# EAGLE schematic VARIABLE_DC_SUPPLY_schematic (EAGLE 9.6.2)
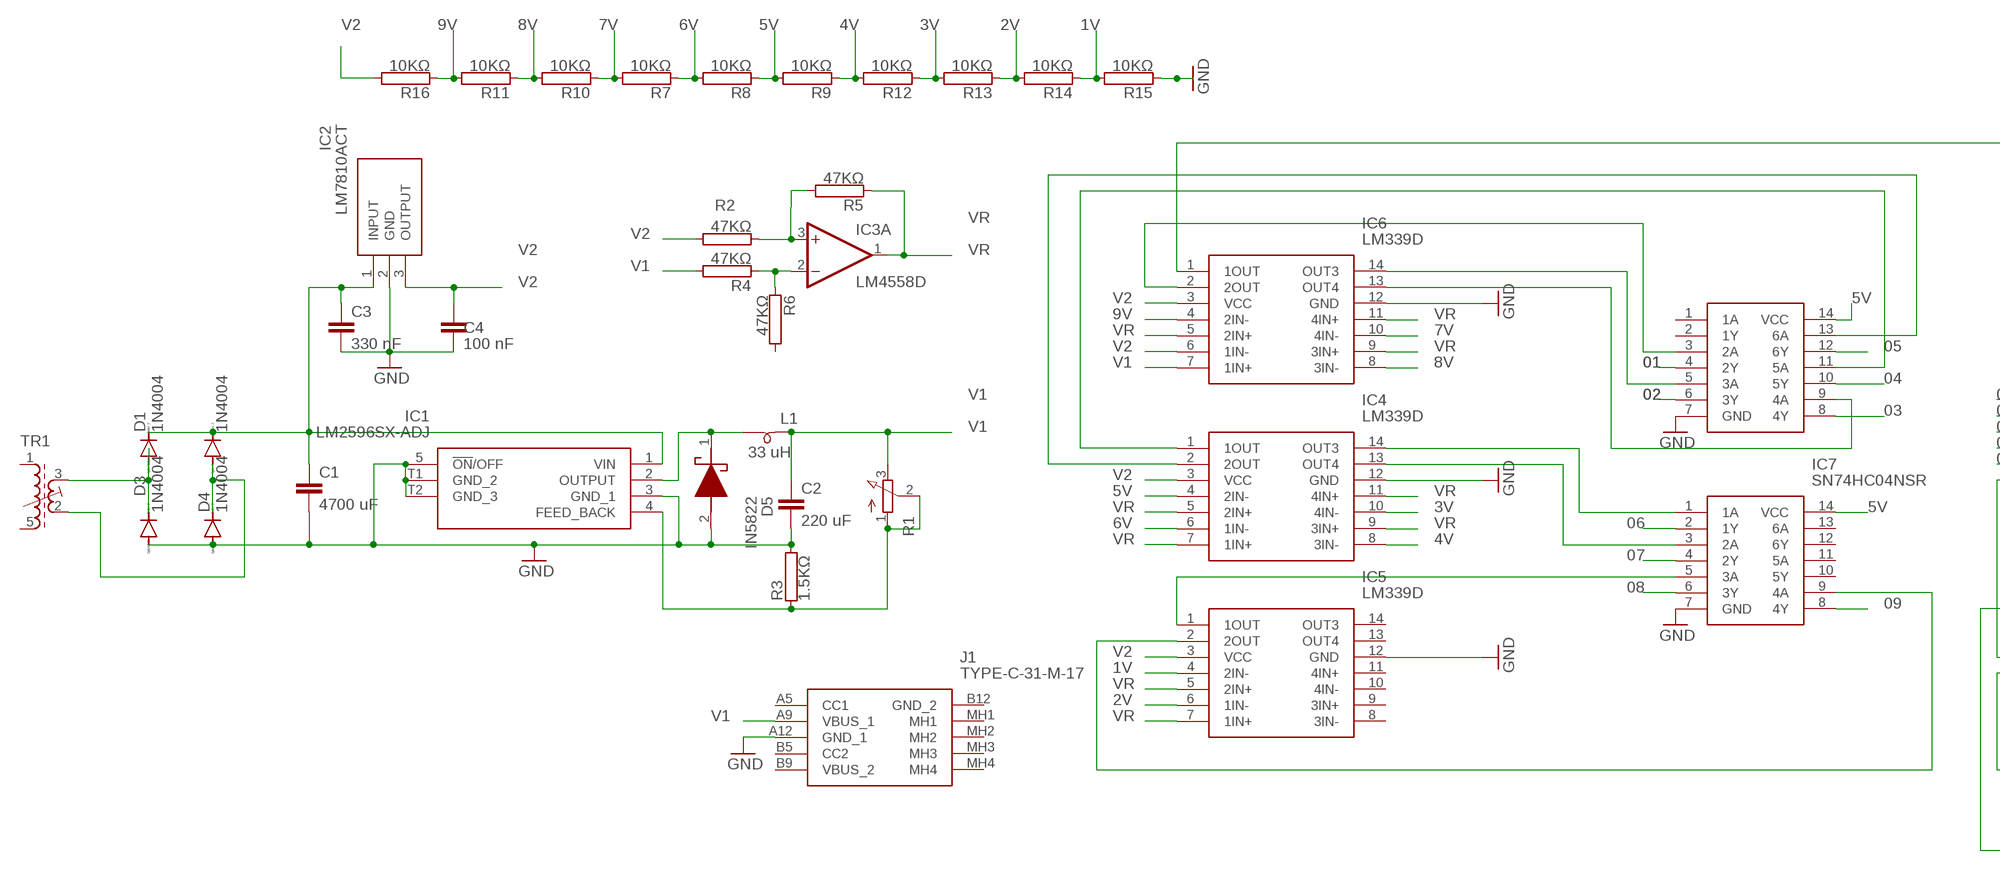
[diagram p0: schematic, sheet 1, part 1 of 2]
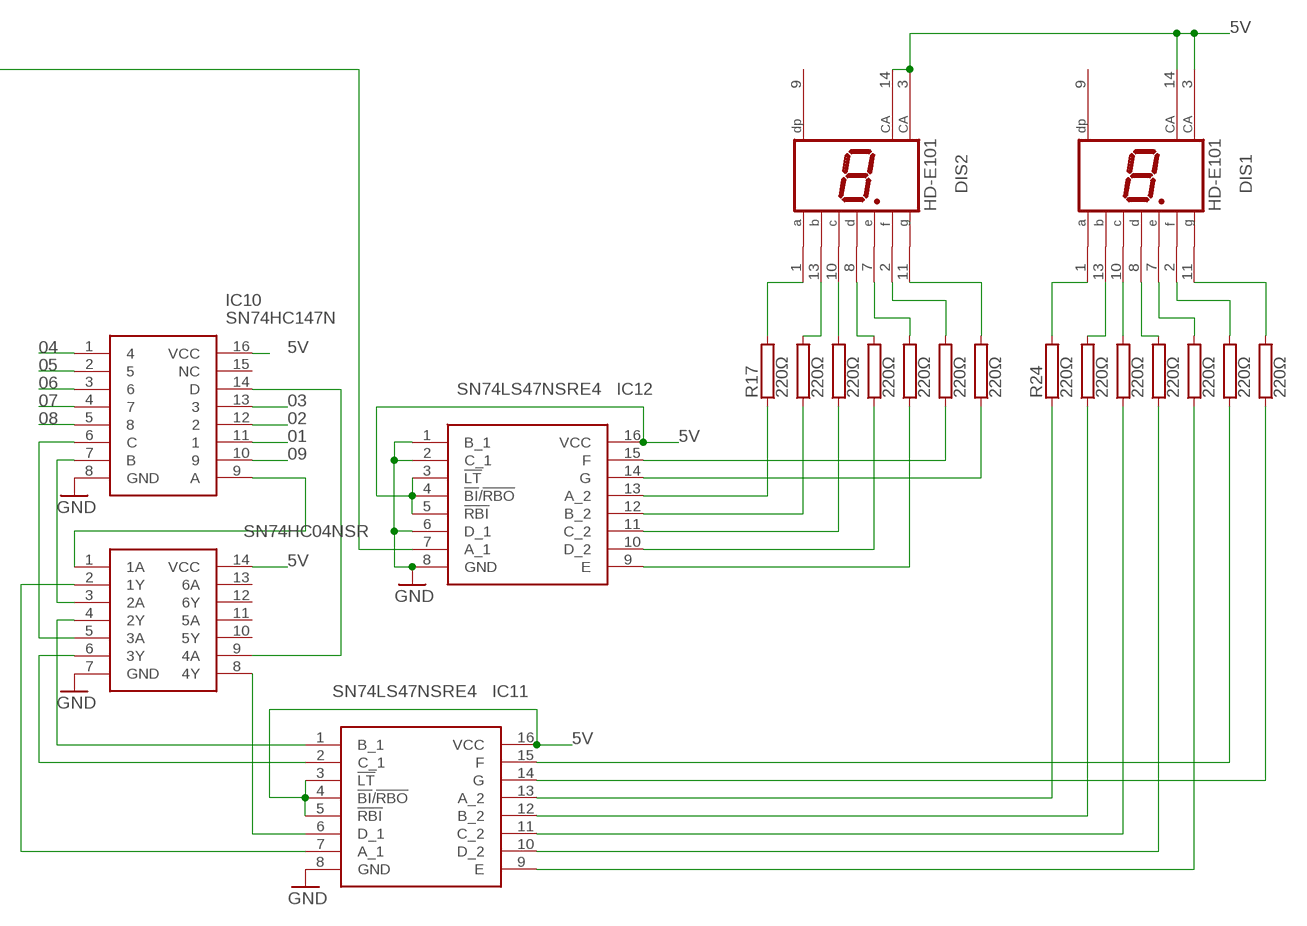
[diagram p1: schematic, sheet 1, part 2 of 2]

## Parts
C1  4700 uF  C2.5/2  [C2.5-2]
C2  220 uF  C2.5/2  [C2.5-2]
C3  330 nF  C2.5/2  [C2.5-2]
C4  100 nF  C2.5/2  [C2.5-2]
D1  1N4004  [DO41-10]
D2  1N4004  [DO41-10]
D3  1N4004  [DO41-10]
D4  1N4004  [DO41-10]
D5  IN5822  [DIOAD3020W130L900D530]
DIS1  HD-E101  [HDSP-I]
DIS2  HD-E101  [HDSP-I]
IC1  LM2596SX-ADJ  [LM2596SXADJ]
IC2  LM7810ACT  [TO254P470X1016X2019-3P]
IC3  LM4558D  [SO08]
IC4  LM339D  [SOIC127P600X175-14N]
IC5  LM339D  [SOIC127P600X175-14N]
IC6  LM339D  [SOIC127P600X175-14N]
IC7  SN74HC04NSR  [SOIC127P780X200-14N]
IC8  SN74HC04NSR  [SOIC127P780X200-14N]
IC9  SN74HC04NSR  [SOIC127P780X200-14N]
IC10  SN74HC147N  [DIP794W53P254L1930H508Q16N]
IC11  SN74LS47NSRE4  [SOIC127P780X200-16N]
IC12  SN74LS47NSRE4  [SOIC127P780X200-16N]
J1  TYPE-C-31-M-17  [TYPEC31M17]
L1  33 uH  SM-B5  [SM-B5]
R1  3RP/1610N  [3RP/1610N]
R2  47KΩ  RMG100-V  [TO-247-2V]
R3  1.5KΩ  RMG100-V  [TO-247-2V]
R4  47KΩ  RMG100-V  [TO-247-2V]
R5  47KΩ  RMG100-V  [TO-247-2V]
R6  47KΩ  RMG100-V  [TO-247-2V]
R7  10KΩ  RMG100-V  [TO-247-2V]
R8  10KΩ  RMG100-V  [TO-247-2V]
R9  10KΩ  RMG100-V  [TO-247-2V]
R10  10KΩ  RMG100-V  [TO-247-2V]
R11  10KΩ  RMG100-V  [TO-247-2V]
R12  10KΩ  RMG100-V  [TO-247-2V]
R13  10KΩ  RMG100-V  [TO-247-2V]
R14  10KΩ  RMG100-V  [TO-247-2V]
R15  10KΩ  RMG100-V  [TO-247-2V]
R16  10KΩ  RMG100-V  [TO-247-2V]
R17  220Ω  RMG100-V  [TO-247-2V]
R18  220Ω  RMG100-V  [TO-247-2V]
R19  220Ω  RMG100-V  [TO-247-2V]
R20  220Ω  RMG100-V  [TO-247-2V]
R21  220Ω  RMG100-V  [TO-247-2V]
R22  220Ω  RMG100-V  [TO-247-2V]
R23  220Ω  RMG100-V  [TO-247-2V]
R24  220Ω  RMG100-V  [TO-247-2V]
R25  220Ω  RMG100-V  [TO-247-2V]
R26  220Ω  RMG100-V  [TO-247-2V]
R27  220Ω  RMG100-V  [TO-247-2V]
R28  220Ω  RMG100-V  [TO-247-2V]
R29  220Ω  RMG100-V  [TO-247-2V]
R30  220Ω  RMG100-V  [TO-247-2V]
TR1  71-4-1532  [71-5]

## Nets
01: IC8.4(2Y) IC10.11
1V: IC5.4(2IN-) R14.1 R15.2
02: IC8.6(3Y) IC10.12
2V: IC5.6(1IN-) R13.1 R14.2
03: IC8.8(4Y) IC10.13
3V: IC4.10(4IN-) R12.1 R13.2
04: IC8.10(5Y) IC10.1
4V: IC4.8(3IN-) R9.1 R12.2
05: IC8.12(6Y) IC10.2
5V: DIS1.3(CA) DIS1.14(CA) DIS2.3(CA) DIS2.14(CA) IC4.4(2IN-) IC7.14(VCC) IC8.14(VCC) IC9.14(VCC) IC10.16(VCC) IC11.3(!LT) IC11.4(!BI!/!RBO) IC11.5(!RBI) IC11.16(VCC) IC12.3(!LT) IC12.4(!BI!/!RBO) IC12.5(!RBI) IC12.16(VCC) R8.1 R9.2
06: IC7.2(1Y) IC10.3
6V: IC4.6(1IN-) R7.1 R8.2
07: IC7.4(2Y) IC10.4
7V: IC6.10(4IN-) R7.2 R10.1
08: IC7.6(3Y) IC10.5
8V: IC6.8(3IN-) R10.2 R11.1
09: IC7.8(4Y) IC10.10
9V: IC6.4(2IN-) R11.2 R16.1
GND: C1.2 C2.2 C3.2 C4.2 D3.A D4.A D5.2(A) IC1.3(GND_1) IC1.5(!ON!/OFF) IC1.T1(GND_2) IC1.T2(GND_3) IC2.2(GND) IC4.12(GND) IC5.12(GND) IC6.12(GND) IC7.7(GND) IC8.7(GND) IC9.7(GND) IC10.8(GND) IC11.8(GND) IC12.1(B_1) IC12.2(C_1) IC12.6(D_1) IC12.8(GND) J1.A12(GND_1) R3.2 R15.1
N$1: D1.A D3.C TR1.3(A2)
N$2: D2.A D4.C TR1.2(E2)
N$3: D5.1(K) IC1.2(OUTPUT) L1.1
N$4: C1.1 C3.1 D1.C D2.C IC1.1(VIN) IC2.1(INPUT)
N$5: IC3.3(A:+IN) R2.1 R5.2
N$6: IC1.4(FEED_BACK) R1.1(A) R1.2(S) R3.1
N$7: IC3.2(A:-IN) R4.1 R6.1
N$8: IC6.2(2OUT) IC8.3(2A)
N$9: IC6.14(OUT3) IC8.5(3A)
N$10: IC6.13(OUT4) IC8.9(4A)
N$11: IC4.1(1OUT) IC8.11(5A)
N$12: IC4.2(2OUT) IC8.13(6A)
N$13: IC4.14(OUT3) IC7.1(1A)
N$14: IC4.13(OUT4) IC7.3(2A)
N$15: IC5.1(1OUT) IC7.5(3A)
N$16: IC5.2(2OUT) IC7.9(4A)
N$17: IC9.1(1A) IC10.9(A)
N$18: IC9.3(2A) IC10.7(B)
N$19: IC9.5(3A) IC10.6(C)
N$20: IC9.9(4A) IC10.14(D)
N$21: DIS2.1(A) R17.2
N$22: IC6.1(1OUT) IC12.7(A_1)
N$23: IC9.2(1Y) IC11.7(A_1)
N$24: IC9.4(2Y) IC11.1(B_1)
N$25: IC9.6(3Y) IC11.2(C_1)
N$26: IC9.8(4Y) IC11.6(D_1)
N$27: DIS2.13(B) R18.2
N$28: DIS2.10(C) R19.2
N$29: DIS2.8(D) R20.2
N$30: DIS2.2(F) R22.2
N$31: DIS2.7(E) R21.2
N$32: DIS2.11(G) R23.2
N$33: DIS1.10(C) R26.2
N$34: DIS1.1(A) R24.2
N$35: DIS1.13(B) R25.2
N$36: DIS1.8(D) R27.2
N$37: DIS1.7(E) R28.2
N$38: DIS1.2(F) R29.2
N$39: DIS1.11(G) R30.2
N$40: IC12.13(A_2) R17.1
N$41: IC12.12(B_2) R18.1
N$42: IC12.11(C_2) R19.1
N$43: IC12.10(D_2) R20.1
N$44: IC12.9(E) R21.1
N$45: IC12.15(F) R22.1
N$46: IC12.14(G) R23.1
N$47: IC11.13(A_2) R24.1
N$48: IC11.12(B_2) R25.1
N$49: IC11.11(C_2) R26.1
N$50: IC11.10(D_2) R27.1
N$51: IC11.9(E) R28.1
N$52: IC11.15(F) R29.1
N$53: IC11.14(G) R30.1
V1: C2.1 IC6.7(1IN+) J1.A9(VBUS_1) L1.2 R1.3(E) R4.2
V2: C4.1 IC2.3(OUTPUT) IC4.3(VCC) IC5.3(VCC) IC6.3(VCC) IC6.6(1IN-) R2.2 R16.2
VR: IC3.1(A:OUT) IC4.5(2IN+) IC4.7(1IN+) IC4.9(3IN+) IC4.11(4IN+) IC5.5(2IN+) IC5.7(1IN+) IC6.5(2IN+) IC6.9(3IN+) IC6.11(4IN+) R5.1
Unconnected: DIS1.9(DP) DIS2.9(DP) IC3.5(B:+IN) IC3.6(B:-IN) IC3.7(B:OUT) IC5.8(3IN-) IC5.9(3IN+) IC5.10(4IN-) IC5.11(4IN+) IC5.13(OUT4) IC5.14(OUT3) IC7.10(5Y) IC7.11(5A) IC7.12(6Y) IC7.13(6A) IC8.1(1A) IC8.2(1Y) IC9.10(5Y) IC9.11(5A) IC9.12(6Y) IC9.13(6A) IC10.15(NC) J1.A5(CC1) J1.B5(CC2) J1.B9(VBUS_2) J1.B12(GND_2) J1.MH1 J1.MH2 J1.MH3 J1.MH4 R6.2 TR1.1(A1) TR1.5(E1) TR1.S1 TR1.S2

## Power pins joined to a net without a drawn wire
V+: IC3.8(P:V+)
V-: IC3.4(P:V-)

## Library data of the parts
C1-C4 = capacitor-wima:C: CAPACITOR naming: grid - package width
D1-D4 = diode:1N4004: DIODE general purpose rectifier, 1 A
D5 = IN5822:IN5822: Axial Schottky Diode Source: Datasheet <https://www.digchip.com/datasheets/download_datasheet.php?id=3516156&part-number=1N5822>; DESCRIPTION: Axial Schottky Diode; HEIGHT: mm; MANUFACTURER_NAME: MULTICOMP; MANUFACTURER_PART_NUMBER: IN5822
DIS1 DIS2 = display-hp:HD-E101: LED DISPLAY 1-character 7 segment, decimal point right; OC_FARNELL: unknown; OC_NEWARK: unknown
IC1 = LM2596SX-ADJ:LM2596SX-ADJ: Switching Voltage Regulators SIMPLE SWITCHER 4.5V to 40V, 3A Low Component Count Step-Down Regulator 5-DDPAK/TO-263 -40 to 125 Source: Datasheet <http://www.ti.com/lit/ds/symlink/lm2596.pdf>; ARROW_PART_NUMBER: LM2596SX-ADJ; ARROW_PRICE-STOCK: https://www.arrow.com/en/products/lm2596sx-adj/texas-instruments?region=nac; DESCRIPTION: Switching Voltage Regulators SIMPLE SWITCHER 4.5V to 40V, 3A Low Component Count Step-Down Regulator 5-DDPAK/TO-263 -40 to 125; HEIGHT: 4.57mm; MANUFACTURER_NAME: Texas Instruments; MANUFACTURER_PART_NUMBER: LM2596SX-ADJ; MOUSER_PART_NUMBER: 926-LM2596SX-ADJ; MOUSER_PRICE-STOCK: https://www.mouser.co.uk/ProductDetail/Texas-Instruments/LM2596SX-ADJ?qs=X1J7HmVL2ZGoPloRewb2pw%3D%3D
IC2 = LM7810ACT:LM7810ACT: IC REG LINEAR 10V 1A TO220-3 Source: Datasheet <https://datasheet.datasheetarchive.com/originals/dk/DKDS-30/585259.pdf>; DESCRIPTION: IC REG LINEAR 10V 1A TO220-3; HEIGHT: 4.7mm; MANUFACTURER_NAME: onsemi; MANUFACTURER_PART_NUMBER: LM7810ACT; MOUSER_PART_NUMBER: 512-LM7810ACT; MOUSER_PRICE-STOCK: https://www.mouser.co.uk/ProductDetail/ON-Semiconductor-Fairchild/LM7810ACT?qs=VOMQJJE%252BBNk%252B1M98xHpUVA%3D%3D
IC3 = linear:*4558: OP AMP
IC4-IC6 = LM339D:LM339D: LM339DG4, Quad Comparator Open Collector 1.3s 4-kanalers 3, 5, 9, 12, 15, 18, 24, 28V 14-Pin SOIC Source: Datasheet <http://www.ti.com/lit/ds/symlink/lm339.pdf>; ARROW_PART_NUMBER: LM339D; ARROW_PRICE-STOCK: https://www.arrow.com/en/products/lm339d/texas-instruments; DESCRIPTION: LM339DG4, Quad Comparator Open Collector 1.3s 4-kanalers 3, 5, 9, 12, 15, 18, 24, 28V 14-Pin SOIC; HEIGHT: 1.75mm; MANUFACTURER_NAME: Texas Instruments; MANUFACTURER_PART_NUMBER: LM339D; MOUSER_PART_NUMBER: 595-LM339D; MOUSER_PRICE-STOCK: https://www.mouser.co.uk/ProductDetail/Texas-Instruments/LM339D?qs=rshUhwi3fbZpzehCSIMPVw%3D%3D
IC7-IC9 = SN74HC04NSR:SN74HC04NSR: Hex Inverters Source: Datasheet <http://www.ti.com/lit/gpn/sn74hc04>; ARROW_PART_NUMBER: SN74HC04NSR; ARROW_PRICE-STOCK: https://www.arrow.com/en/products/sn74hc04nsr/texas-instruments?region=nac; DESCRIPTION: Hex Inverters; HEIGHT: 2mm; MANUFACTURER_NAME: Texas Instruments; MANUFACTURER_PART_NUMBER: SN74HC04NSR; MOUSER_PART_NUMBER: 595-SN74HC04NSR; MOUSER_PRICE-STOCK: https://www.mouser.co.uk/ProductDetail/Texas-Instruments/SN74HC04NSR?qs=mE33ZKBHyE7T4CYN%2FhoKqg%3D%3D
IC10 = SN74HC147N:SN74HC147N: ENCODER, 16 Pin, Plastic, DIP Source: Datasheet <https://www.datasheets360.com/pdf/5543914288533637560>; DESCRIPTION: ENCODER, 16 Pin, Plastic, DIP; HEIGHT: 5.08mm; MANUFACTURER_NAME: Texas Instruments; MANUFACTURER_PART_NUMBER: SN74HC147N
IC11 IC12 = SN74LS47NSRE4:SN74LS47NSRE4: IC BCD-7-SEG DECOD/DRVR 16SO Source: Datasheet <http://www.ti.com/lit/ds/symlink/sn7447a.pdf>; DESCRIPTION: IC BCD-7-SEG DECOD/DRVR 16SO; HEIGHT: 2mm; MANUFACTURER_NAME: Texas Instruments; MANUFACTURER_PART_NUMBER: SN74LS47NSRE4
J1 = TYPE-C-31-M-17:TYPE-C-31-M-17: USB Connectors 6 Receptacle 1 RoHS Source: Datasheet <https://datasheet.lcsc.com/szlcsc/1903211732_Korean-Hroparts-Elec-TYPE-C-31-M-17_C283540.pdf>; DESCRIPTION: USB Connectors 6 Receptacle 1 RoHS; HEIGHT: 3.26mm; MANUFACTURER_NAME: Korean Hroparts Elec; MANUFACTURER_PART_NUMBER: TYPE-C-31-M-17
L1 = inductor-neosid:SM-B: INDUCTOR SMD Bead inductor; OC_FARNELL: unknown; OC_NEWARK: unknown
R1 = pot:3RP/1610N: 16mm Potentiometer one level Source: http://www.alphapotentiometers.net/html/16mm_pot_2.html
R2-R30 = resistor-power:RMG100: TO-247 Power Resistor - RMG 100 Series Source: www.token.com.tw .. power-resistor-rmg100pdf; OC_FARNELL: unknown; OC_NEWARK: unknown
TR1 = inductor-neosid:71-4-: TRANSFORMER adjustable filter transformer; OC_FARNELL: unknown; OC_NEWARK: unknown